# EAGLE design pmon_oled (EAGLE 6.5.0)
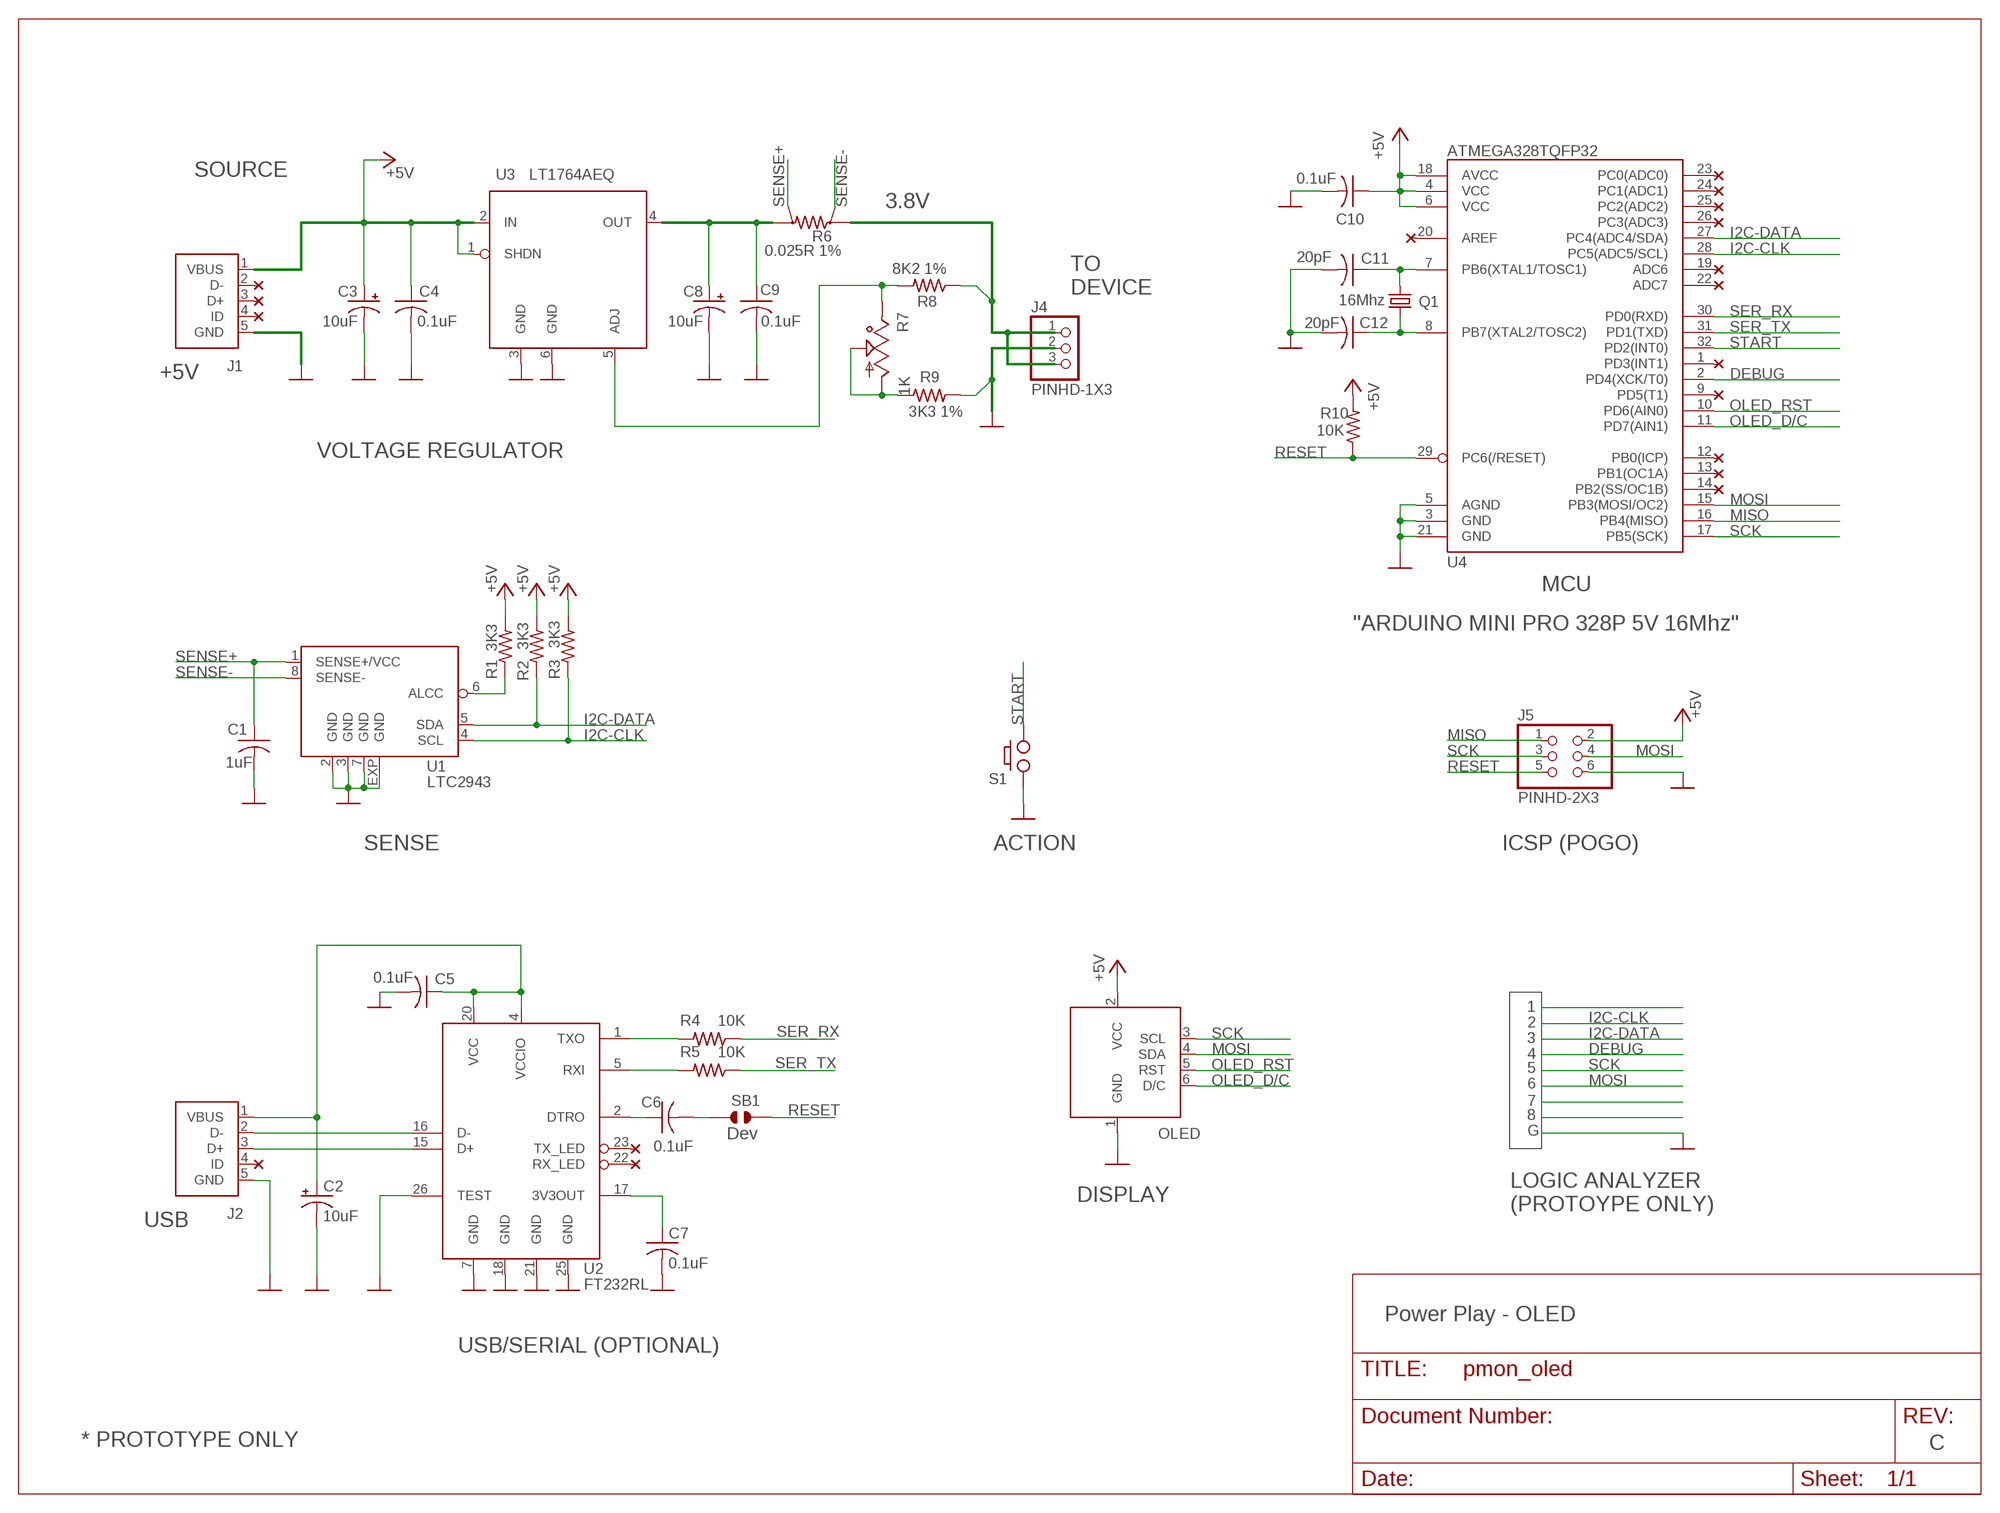
[diagram p0: schematic, sheet 1]

## Parts
C1  1uF  CAP-C0603  [C0603]
C2  10uF  CPOL-USA/3216-18R  [A/3216-18R]
C3  10uF  CPOL-USA/3216-18R  [A/3216-18R]
C4  0.1uF  CAP-C0603  [C0603]
C5  0.1uF  CAP-C0603  [C0603]
C6  0.1uF  CAP-C0603  [C0603]
C7  0.1uF  CAP-C0603  [C0603]
C8  10uF  CPOL-USA/3216-18R  [A/3216-18R]
C9  0.1uF  CAP-C0603  [C0603]
C10  0.1uF  CAP-C0603  [C0603]
C11  20pF  CAP-C0603  [C0603]
C12  20pF  CAP-C0603  [C0603]
J1  USB  [USB-MICRO-ZX62RD-AB-5P8]
J2  USB  [USB-MICRO-ZX62RD-AB-5P8]
J4  PINHD-1X3  [1X03]
J5  PINHD-2X3  [2X03]
OLED  OLED  [OLED]
Q1  16Mhz  CRYSTALCTS406  [CRYSTAL-CTS406]
R1  3K3  RES-R0603  [R0603]
R2  3K3  RES-R0603  [R0603]
R3  3K3  RES-R0603  [R0603]
R4  10K  RES-R0603  [R0603]
R5  10K  RES-R0603  [R0603]
R6  0.025R 1%  RES-SHUNT-6432  [KELVIN-6432]
R7  1K  TRIM_US-SM-42/43A  [TRIM-POT_SM-42/43A]
R8  8K2 1%  RES-R0603  [R0603]
R9  3K3 1%  RES-R0603  [R0603]
R10  10K  RES-R0603  [R0603]
S1  PUSH_BUTTON  [TLE1105]
SB1  JUMPER_SOLDER_1X2  [JUMPER_SOLDER_1X2]
U1  LTC2943  [DFN8-3X3]
U2  FT232RL  [SSOP28DB]
U3  LT1764AEQ  LTE1764  [TO263-5]
U4  ATMEGA328TQFP32  [TQFP32-08]

## Nets
+5V: C3.+ C4.1 C10.1 J1.1(VBUS) J5.2 OLED.2(VCC) R1.2 R2.2 R3.2 R10.2 U3.1(SHDN) U3.2(IN) U4.4(VCC) U4.6(VCC) U4.18(AVCC)
DEBUG: U4.2(PD4(XCK/T0))
GND: C1.2 C2.- C3.- C4.2 C5.2 C7.2 C8.- C9.2 C10.2 C11.2 C12.2 J1.5(GND) J2.5(GND) J4.2 J5.6 OLED.1(GND) R9.2 S1.A U1.2(GND) U1.3(GND) U1.7(GND) U1.EXP(GND) U2.7(GND) U2.18(GND) U2.21(GND) U2.25(GND) U2.26(TEST) U3.3(GND) U3.6(GND) U4.3(GND) U4.5(AGND) U4.21(GND)
I2C-CLK: R3.1 U1.4(SCL) U4.28(PC5(ADC5/SCL))
I2C-DATA: R2.1 U1.5(SDA) U4.27(PC4(ADC4/SDA))
MISO: J5.1 U4.16(PB4(MISO))
MOSI: J5.4 OLED.4(SDA) U4.15(PB3(MOSI/OC2))
N$1: R1.1 U1.6(ALCC)
N$2: C11.1 Q1.1 U4.7(PB6(XTAL1/TOSC1))
N$6: R4.2 U2.1(TXO)
N$7: C12.1 Q1.3 U4.8(PB7(XTAL2/TOSC2))
N$8: R5.2 U2.5(RXI)
N$9: C8.+ C9.1 R6.I2 U3.4(OUT)
N$10: J2.3(D+) U2.15(D+)
N$11: C6.1 U2.2(DTRO)
N$12: C6.2 SB1.1
N$15: J2.2(D-) U2.16(D-)
N$16: C7.1 U2.17(3V3OUT)
N$18: R7.1 R7.2 R9.1
N$19: R7.3 R8.2 U3.5(ADJ)
N$22: J4.1 J4.3 R6.I1 R8.1
OLED_D/C: OLED.6(D/C) U4.11(PD7(AIN1))
OLED_RST: OLED.5(RST) U4.10(PD6(AIN0))
RESET: J5.5 R10.1 SB1.2 U4.29(PC6(/RESET))
SCK: J5.3 OLED.3(SCL) U4.17(PB5(SCK))
SENSE+: C1.1 R6.V2 U1.1(SENSE+/VCC)
SENSE-: R6.V1 U1.8(SENSE-)
SER_RX: R4.1 U4.30(PD0(RXD))
SER_TX: R5.1 U4.31(PD1(TXD))
START: S1.B U4.32(PD2(INT0))
VUSB: C2.+ C5.1 J2.1(VBUS) U2.4(VCCIO) U2.20(VCC)
Unconnected: J1.2(D-) J1.3(D+) J1.4(ID) J2.4(ID) U2.22(RX_LED) U2.23(TX_LED) U4.1(PD3(INT1)) U4.9(PD5(T1)) U4.12(PB0(ICP)) U4.13(PB1(OC1A)) U4.14(PB2(SS/OC1B)) U4.19(ADC6) U4.20(AREF) U4.22(ADC7) U4.23(PC0(ADC0)) U4.24(PC1(ADC1)) U4.25(PC2(ADC2)) U4.26(PC3(ADC3))

## Notes on the sheet
- SOURCE
- 3.8V
- TO
  DEVICE
- +5V
- VOLTAGE REGULATOR
- MCU
- "ARDUINO MINI PRO 328P 5V 16Mhz"
- SENSE | ACTION | ICSP (POGO)
- 1
- 2
- 3
- 4
- 5
- 6
- 7
- 8
- Dev | G
- DISPLAY
- LOGIC ANALYZER
  (PROTOYPE ONLY)
- USB
- Power Play - OLED
- USB/SERIAL (OPTIONAL)
- * PROTOTYPE ONLY | C

## Library data of the parts
C1 C4-C7 C9-C12 = pmon_oled:CAP-: CAPACITOR, American symbol
C2 C3 C8 = pmon_oled:CPOL-US
J1 J2 = pmon_oled:USB
J4 = pmon_oled:PINHD-1X3: PIN HEADER
J5 = pmon_oled:PINHD-2X3
OLED = pmon_oled:OLED
Q1 = pmon_oled:CRYSTAL: CRYSTAL; OC_FARNELL: unknown; OC_NEWARK: unknown
R1-R5 R8-R10 = pmon_oled:RES-: RESISTOR, American symbol
R6 = pmon_oled:RES-SHUNT-: SMD SHUNT RESISTOR
R7 = pmon_oled:TRIM_US-: POTENTIOMETER
S1 = pmon_oled:PUSH_BUTTON
SB1 = pmon_oled:JUMPER_SOLDER_1X2
U1 = pmon_oled:LTC2943
U2 = pmon_oled:FT232RL
U3 = pmon_oled:LTE1764
U4 = pmon_oled:ATMEGA328

## Net classes
1 power: width 0.254 mm

## Board
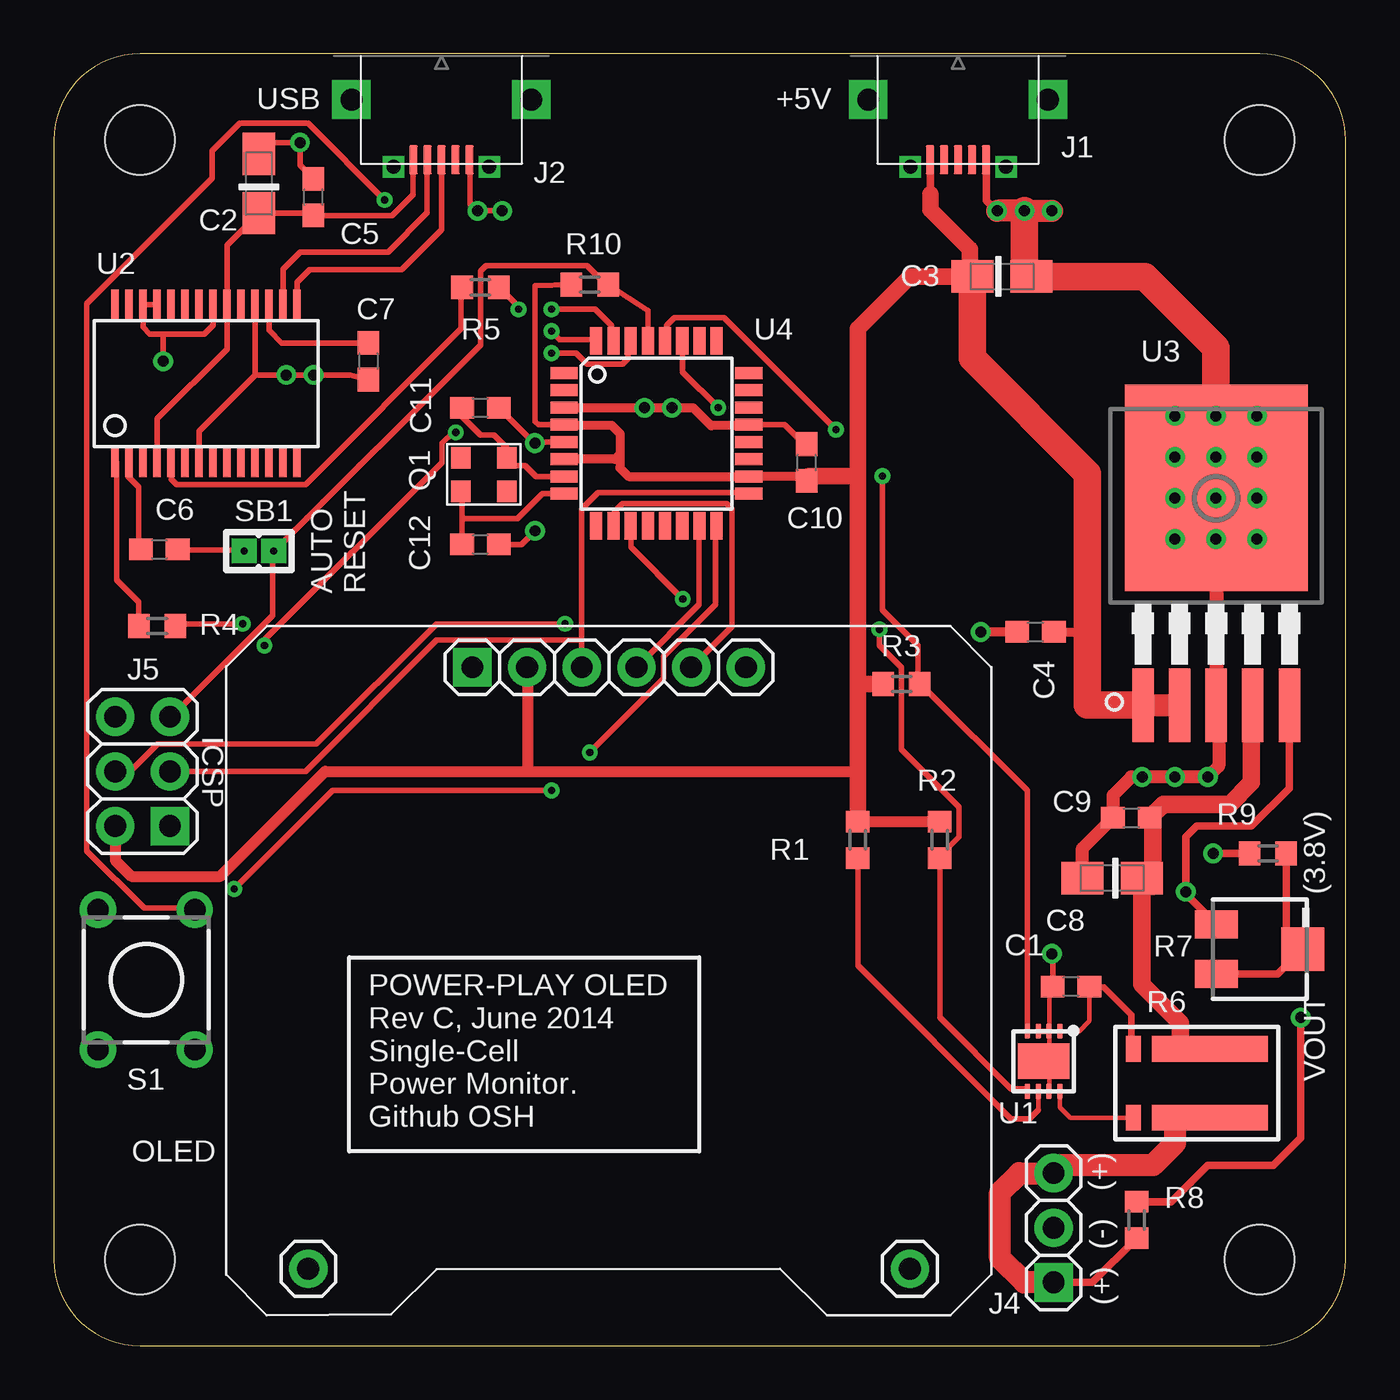
[diagram p1: board, top side]
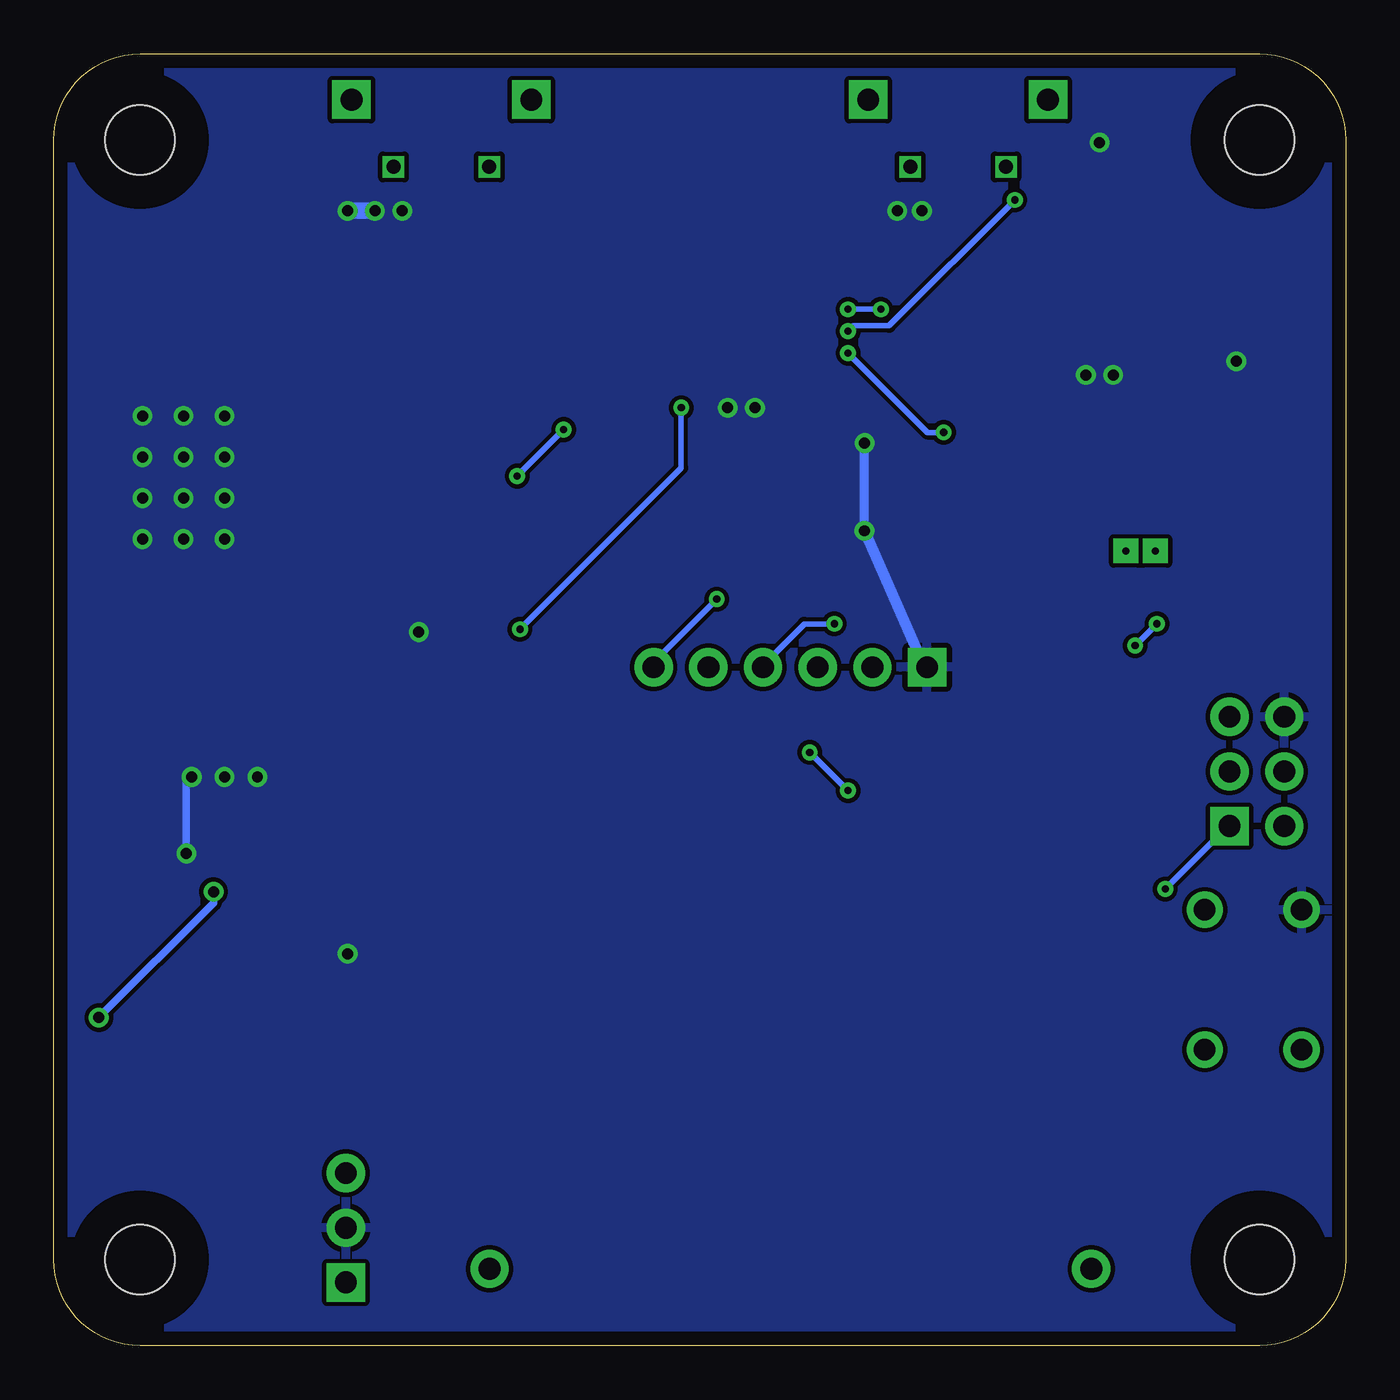
[diagram p2: board, bottom side, seen from below]

Size 60 x 60 mm. Coordinates in mm from the lower left corner, seen from the top.
Outline: 4,0 56,0 arc90 60,4 60,56 arc90 56,60 4,60 arc90 0,56 0,4 arc90 4,0
Copper layers (1*16): Top 0.035mm / dielectric 1.5mm / Bottom 0.035mm
Design rules "default *": minimum track width 10mil, minimum drill 13mil, track to track 8mil, track to pad 8mil, pad to pad 8mil, via to via 8mil, smd to smd 0mil, copper to edge 25mil, drill to drill 8mil, minimum pad ring 7mil, minimum via ring 8mil, stop-mask expansion 4mil, vias tented up to drill 20mil, thermal gap 10mil
Holes 3.2 mm at 4,4 56,4 4,56 56,56
tKeepout: area 1,53 to 7,59
tRestrict: area 53,1 to 59,7; area 1,1 to 7,7; area 53,53 to 59,59; area 1,53 to 7,59
bRestrict: area 1,53 to 7,59; area 1,1 to 7,7; area 53,53 to 59,59; area 53,1 to 59,7

### Footprints (pad centres in the part's own frame; a part is rotated, then mirrored left to right if it is on the bottom)
C0603 = smd 1.1 x 1: 1 -0.85,0; 2 0.85,0
A/3216-18R = smd 1.95 x 1.5: + 1.375,0; - -1.375,0
USB-MICRO-ZX62RD-AB-5P8 = smd 0.4 x 1.35: 1 1.3,5.425; 2 0.65,5.425; 3 0,5.425; 4 -0.65,5.425; 5 -1.3,5.425 | drill 1.016 pad 1.778 square: A -4.175,2.625; D 4.175,2.625 | drill 0.65 pad 0.914 square: B -2.225,5.75; C 2.225,5.75
1X03 = drill 1.016 pad 1.778 square: 1 -2.54,0 | drill 1.016 pad 1.778: 2 0,0; 3 2.54,0
2X03 = drill 1.016 pad 1.778 square: 1 -2.54,-1.27 | drill 1.016 pad 1.778: 2 -2.54,1.27; 3 0,-1.27; 4 0,1.27; 5 2.54,-1.27; 6 2.54,1.27
OLED = drill 1.016 pad 1.778 square: 1 0,0 | drill 1.016 pad 1.778: 2 2.54,0; 3 5.08,0; 4 7.62,0; 5 10.16,0; 6 12.7,0; 7 20.32,-27.94; 8 -7.62,-27.94
CRYSTAL-CTS406 = smd 0.9 x 1: 1 -1.075,-0.775; 2 1.075,-0.775; 3 1.075,0.775; 4 -1.075,0.775
R0603 = smd 1 x 1.1: 1 -0.85,0; 2 0.85,0
KELVIN-6432 = smd 1.2 x 5.4: I1 -1.6,2.7; I2 1.6,2.7 | smd 1.2 x 0.7: V1 -1.6,6.25; V2 1.6,6.25
TRIM-POT_SM-42/43A = smd 2 x 1.3: 1 2,1.15; 3 2,-1.15 | smd 2 x 2: 2 -2,0
TLE1105 = drill 1 pad 1.676: A -2.25,3.25; AX -2.25,-3.25; B 2.25,3.25; BX 2.25,-3.25
JUMPER_SOLDER_1X2 = drill 0.33 pad 1.143 square: 1 -0.686,0; 2 0.686,0
DFN8-3X3 = smd 0.25 x 0.7: 1 -0.75,-1.4; 2 -0.25,-1.4; 3 0.25,-1.4; 4 0.75,-1.4; 5 0.75,1.4; 6 0.25,1.4; 7 -0.25,1.4; 8 -0.75,1.4 | smd 2.38 x 1.65: EXP 0,0
SSOP28DB = smd 0.348 x 1.397: 1 -4.225,-3.656; 2 -3.575,-3.656; 3 -2.925,-3.656; 4 -2.275,-3.656; 5 -1.625,-3.656; 6 -0.975,-3.656; 7 -0.325,-3.656; 8 0.325,-3.656; 9 0.975,-3.656; 10 1.625,-3.656; 11 2.275,-3.656; 12 2.925,-3.656; 13 3.575,-3.656; 14 4.225,-3.656; 15 4.225,3.656; 16 3.575,3.656; 17 2.925,3.656; 18 2.275,3.656; 19 1.625,3.656; 20 0.975,3.656; 21 0.325,3.656; 22 -0.325,3.656; 23 -0.975,3.656; 24 -1.625,3.656; 25 -2.275,3.656; 26 -2.925,3.656; 27 -3.575,3.656; 28 -4.225,3.656
TO263-5 = smd 1 x 3.4: 1 -3.4,-6.6; 2 -1.7,-6.6; 3 0,-6.6; 4 1.7,-6.6; 5 3.4,-6.6 | smd 8.5 x 9.6: 6 0,3.5
TQFP32-08 = smd 1.27 x 0.559: 1 -4.293,2.8; 2 -4.293,2; 3 -4.293,1.2; 4 -4.293,0.4; 5 -4.293,-0.4; 6 -4.293,-1.2; 7 -4.293,-2; 8 -4.293,-2.8; 17 4.293,-2.8; 18 4.293,-2; 19 4.293,-1.2; 20 4.293,-0.4; 21 4.293,0.4; 22 4.293,1.2; 23 4.293,2; 24 4.293,2.8 | smd 0.559 x 1.27: 9 -2.8,-4.293; 10 -2,-4.293; 11 -1.2,-4.293; 12 -0.4,-4.293; 13 0.4,-4.293; 14 1.2,-4.293; 15 2,-4.293; 16 2.8,-4.293; 25 2.8,4.293; 26 2,4.293; 27 1.2,4.293; 28 0.4,4.293; 29 -0.4,4.293; 30 -1.2,4.293; 31 -2,4.293; 32 -2.8,4.293

### Placement (x,y rotation side)
C1  47.24,16.68 180 top
C2  9.53,53.98 270 top
C3  44.04,49.66 180 top
C4  45.59,33.15 180 top
C5  12.06,53.34 90 top
C6  4.9,36.98 0 top
C7  14.61,45.72 270 top
C8  49.15,21.72 0 top
C9  50.04,24.51 180 top
C10  34.98,41.02 90 top
C11  19.81,43.56 0 top
C12  19.81,37.21 0 top
J1  42,60.5 180 top
J2  18,60.5 180 top
J4  46.44,5.47 90 top
J5  4.12,26.67 90 top
OLED  19.44,31.51 0 top
Q1  19.97,40.47 180 top
R1  37.34,23.5 90 top
R2  41.15,23.5 90 top
R3  39.37,30.73 180 top
R4  4.8,33.43 180 top
R5  19.81,49.15 180 top
R6  56.39,12.19 90 top
R7  56,18.41 180 top
R8  50.29,5.84 90 top
R9  56.39,22.86 180 top
R10  24.89,49.28 180 top
S1  4.3,17 0 top
SB1  9.53,36.91 0 top
U1  45.97,13.21 180 top
U2  7.07,44.69 0 top
U3  53.98,36.34 0 top
U4  27.99,42.37 0 top

### Tracks (layer width: path | path; a pad name or v marks a point on that pad's centre or on a via)
+5V
  Top 0.254: 23.72,42.75 U4.4 22.51,42.77 22.35,42.93 22.35,49.24 R10.2 | U4.18 32.3,40.39 | 35.05,40.39 34.98,40.31 C10.1
  Top 0.356: J1.1 40.72,55.08 40.72,53.49
  Top 0.406: 23.72,42.75 25.91,42.75 26.29,42.37 26.29,41.4 | 32.3,40.39 35.05,40.39 | C4.1 48.01,33.15 48.01,36.96 47.88,36.96 | 26.29,41.4 26.06,41.17 U4.6 | 26.29,41.4 26.29,40.77 26.68,40.37 U4.18 | C3.+ 42.55,49.77
  Top 0.508: R1.2 R2.2 | OLED.2 22,31.49 22,26.67 | 22,26.67 37.34,26.67 | J5.2 2.85,22.55 3.6,21.8 7.74,21.8 12.61,26.67 22,26.67
  Top 0.762: 35.05,40.39 37.34,40.39 | 48.01,40.39 48.01,40.51 | R1.2 37.34,26.67 37.34,30.73 | 37.34,30.73 37.34,40.39 | R3.2 37.34,30.73 | 37.34,40.39 37.34,47.24 39.75,49.66 C3.+ | 42.55,49.77 42.55,50.93 40.72,52.76 40.72,53.49
  Top 1.016: U3.1 U3.2
  Top 1.27: U3.1 48.01,29.75 48.01,33.15 48.01,40.51 42.66,45.86 C3.+
GND  (via drill 0.51)
  Top 0.203: 46.35,16.64 46.23,16.64 46.23,14.56 U1.2 46.23,14.55 46.23,13.82 45.97,13.56 U1.EXP 45.97,12.85 46.23,12.6 46.23,11.86 U1.7
  Top 0.254: 46.1,16.67 46.23,16.68 C1.2 46.39,18.16 v46.35,18.2 | C12.2 21.72,37.21 v22.35,37.85 | U4.5 22.39,41.97 v22.34,41.92 22.3,41.92 C11.2 | U4.3 | 32.23,42.72 U4.21 33.94,42.77 34.84,41.87 C10.2 | C2.- 9.53,55.88 v11.43,55.88 11.43,54.83 C5.2 | J2.5 19.33,55.05 19.33,53.01 19.63,52.7 v19.68,52.7 v20.83,52.7 | C7.2 13.76,45.09 v12.06,45.09 v10.79,45.09 9.34,45.09 | 9.34,45.09 U2.18 | U2.7 6.74,42.48 9.34,45.09 | 5.08,46.99 4.45,46.99 4.14,47.3 U2.26 U2.25 | 5.08,46.99 6.99,46.99 7.39,47.4 U2.21 | 5.08,46.99 v5.08,45.72 | U1.3 45.85,14.61 46.1,14.61 U1.2
  Top 0.356: J1.5 43.31,53.17 43.78,52.7 v43.81,52.7 | U3.3 54.1,29.63 | v50.55,26.42 50.04,26.42 | R9.2 v53.85,22.86
  Top 0.406: U4.3 v27.43,43.56 v28.7,43.56 29.69,43.56 30.53,42.72 32.23,42.72 | 46.35,52.78 v46.35,52.7 | C4.2 v43.05,33.15 | 46.23,16.64 46.39,16.64 C1.2 | 45.09,49.91 45.47,49.53
  Top 0.61: 54.1,29.63 54.1,26.92 v53.59,26.42 v52.07,26.42 v50.55,26.42 | 50.04,26.42 49.19,25.57 C9.2 47.77,23.1 C8.-
  Top 0.66: U3.6 U3.3
  Top 1.016: v43.81,52.7 v45.09,52.7 v46.35,52.7
  Top 1.27: C3.- 50.67,49.66 53.98,46.35 v53.98,41.27 | v45.09,52.7 45.09,49.91
  Bottom 0.356: v53.85,22.86 53.85,26.16 v53.59,26.42
  Bottom 0.406: v22.35,37.85 v22.34,41.92
  Bottom 0.508: v22.35,37.85 19.68,31.75 19.48,31.55
  Bottom 0.762: v46.35,52.7 v45.09,52.7
  other vias: 53.98,39.37 52.07,43.18 53.98,43.18 55.88,43.18 52.07,39.37 52.07,37.47 53.98,37.47 55.88,37.47 55.88,39.37 55.88,41.27 52.07,41.27
  pour Bottom: 0,60 60,60 60,0 0,0
I2C-CLK  (via drill 0.33)
  Top 0.254: U1.4 45.21,25.78 40.26,30.73 R3.1 40.13,30.73 40.13,32.51 38.48,34.16 v38.48,40.39 | v36.32,42.55 31.11,47.75 28.83,47.75 28.45,47.37 28.45,46.74 U4.28
  Bottom 0.254: v38.48,40.39 v36.32,42.55
I2C-DATA  (via drill 0.33)
  Top 0.254: U1.5 45.21,11.94 44.45,11.94 41.15,15.24 41.15,15.49 41.15,15.88 R2.1 41.15,22.73 42.04,23.62 42.04,25.02 39.37,27.69 39.37,31.5 38.35,32.51 v38.35,33.27 | v30.86,43.56 29.21,45.21 29.21,46.61 U4.27
  Bottom 0.254: v30.86,43.56 30.86,40.77 v38.35,33.27
MISO  (via drill 0.33)
  Top 0.254: v24.89,27.56 28.32,30.99 28.32,32 30.73,34.42 30.73,37.97 U4.16 | v23.11,25.78 12.95,25.78 v8.38,21.21
  Bottom 0.254: v23.11,25.78 v24.89,27.56 | v8.38,21.21 5.46,24.13 J5.1
MOSI  (via drill 0.33)
  Top 0.254: U4.15 29.97,37.97 29.97,34.42 27.18,31.62 OLED.4 | J5.4 3.56,26.67 4.83,27.94 12.19,27.94 17.78,33.53 v23.75,33.53
  Bottom 0.254: v23.75,33.53 25.15,33.53 27.05,31.62 OLED.4
N$1
  Top 0.203: U1.6 45.72,10.95
  Top 0.254: R1.1 37.34,17.65 44.45,10.54 45.31,10.54 45.72,10.95 | U1.6
N$2
  Top 0.254: U4.7 22.39,40.37 21.89,40.87 21.42,40.87 Q1.1 21.05,41.69 20.45,42.29 19.81,42.29 18.96,43.14 C11.1
N$6
  Top 0.254: R4.2 3.94,33.53 3.94,34.54 2.92,35.56 2.92,41.02 U2.1
N$7
  Top 0.254: Q1.3 18.96,39.69 18.96,38.48 | 18.96,38.48 C12.1 | U4.8 22.7,39.57 21.54,38.41 19.04,38.41 18.96,38.48
N$8
  Top 0.254: R5.2 18.92,49.15 18.92,47.24 11.68,40.01 5.71,40.01 5.46,40.26 5.46,41.02 U2.5
N$9
  Top 0.356: U3.4 55.63,29.69 | C9.1 51.05,24.34 | 51.05,21.34 50.67,21.72 C8.+ | 52.58,13.97 52.83,13.72 53.61,13.72 R6.I2
  Top 0.813: 51.05,24.34 51.05,21.34 | 55.63,29.69 55.63,26.16 54.61,25.15 51.52,25.15 C9.1 | 52.58,13.97 52.32,14.22 52.32,14.99 50.52,16.79 C8.+
N$10
  Top 0.254: J2.3 18.01,55.07 18.01,51.84 16.15,49.99 11.89,49.99 11.29,49.39 U2.15
N$11
  Top 0.254: 3.43,41.02 U2.2 3.43,40.89 3.43,40.39 3.94,39.88 3.94,37.08 C6.1
N$12
  Top 0.254: 8.76,36.96 8.81,36.96 | 8.76,36.96 5.84,36.96 C6.2 | 8.76,36.96 SB1.1
N$15
  Top 0.254: J2.2 17.35,52.63 15.52,50.8 11.43,50.8 10.64,50.01 U2.16
N$16
  Top 0.254: U2.17 9.99,47.16 10.58,46.57 C7.1
N$18
  Top 0.356: R9.1 57.24,19.18 R7.2 56.85,17.27 R7.1
N$19  (via drill 0.51)
  Top 0.356: U3.5 57.38,25.89 55.63,24.13 53.09,24.13 52.58,23.62 v52.58,21.08 52.58,20.99 R7.3 | v57.91,15.24 57.91,9.65 56.64,8.38 53.59,8.38 51.9,6.69 R8.2
  Bottom 0.356: v57.91,15.24 52.58,20.57 v52.58,21.08
N$22
  Top 0.356: R6.I1 53.51,10.41 52.07,10.41 | R8.1 48.23,2.94 J4.1
  Top 1.016: 52.07,10.41 52.07,9.4 51.05,8.38 46.8,8.38 J4.3 44.84,8.02 43.94,7.11 43.94,4.06 45.07,2.94 J4.1
OLED_D/C  (via drill 0.33)
  Top 0.254: v29.21,34.67 26.8,37.08 26.8,37.97 U4.11
  Bottom 0.254: v29.21,34.67 32.26,31.62 OLED.6
OLED_RST
  Top 0.254: U4.10 26.04,38.1 26.04,38.73 26.42,39.12 31.24,39.12 31.5,38.86 31.5,33.4 29.72,31.62 OLED.5
RESET
  Top 0.254: U4.29 27.59,48.07 R10.1 25.65,49.28 24.77,50.16 20.07,50.16 19.81,49.91 19.81,46.48 10.29,36.96 SB1.2 10.16,36.83 10.16,33.91 5.46,29.21 J5.5
  Top 0.406: SB1.2 10.22,36.92
SCK
  Top 0.254: 32.38,39.5 U4.17 32.26,39.62 25.27,39.62 24.51,38.86 24.51,32.77 | 24.51,32.77 24.51,31.62 OLED.3 | J5.3 11.68,26.67 17.78,32.77 24.51,32.77
SENSE+
  Top 0.203: U1.1 46.77,14.61 47.62,14.61 48.09,15.07 C1.1 | 50.05,13.79 R6.V2
  Top 0.305: C1.1 48.77,16.64 50.04,15.37 50.04,13.79 50.05,13.79
SENSE-
  Top 0.203: U1.8 46.74,11.85 46.74,11.07 47.22,10.59 R6.V1
SER_RX  (via drill 0.33)
  Top 0.254: v8.76,33.53 5.71,33.53 R4.1 | v9.78,32.51 9.78,32.77 18.03,41.02 18.03,41.91 18.54,42.42 v18.67,42.42 | v23.11,46.1 24.26,46.1 24.77,45.59 26.42,45.59 26.67,45.85 26.67,46.61 U4.30
  Bottom 0.254: v9.78,32.51 v8.76,33.53 | v18.67,42.42 19.43,42.42 v23.11,46.1
SER_TX  (via drill 0.33)
  Top 0.254: v21.59,48.13 21.59,48.26 20.7,49.15 R5.1 | v23.11,48.13 25.15,48.13 25.91,47.37 25.91,46.74 U4.31
  Bottom 0.254: v23.11,48.13 v21.59,48.13
START  (via drill 0.33)
  Top 0.254: v23.11,47.12 23.5,46.74 25.15,46.74 U4.32 | v15.37,53.21 11.81,56.77 8.64,56.77 7.37,55.5 7.37,54.23 1.52,48.39 1.52,22.99 4.19,20.32 6.48,20.32 S1.B
  Bottom 0.254: v23.11,47.12 22.86,47.37 21.21,47.37 v15.37,53.21
VUSB
  Top 0.254: J2.1 16.69,55.06 16.69,53.47 15.71,52.49 C5.1 11.96,52.6 C2.+ 8.04,51.12 U2.20 8.04,46.29 4.8,43.05 4.8,41.05 U2.4

### Text on the board
tPlace: USB | +5V | AUTO / RESET | ICSP | (3.8V) | VOUT | POWER-PLAY OLED / Rev C, June 2014 / Single-Cell / Power Monitor. / Github OSH | (+) | (-) | (+)
bStop: POWER-PLAY OLED - REV C / OSH GITHUB